# Altium project Quad.PrjPcb
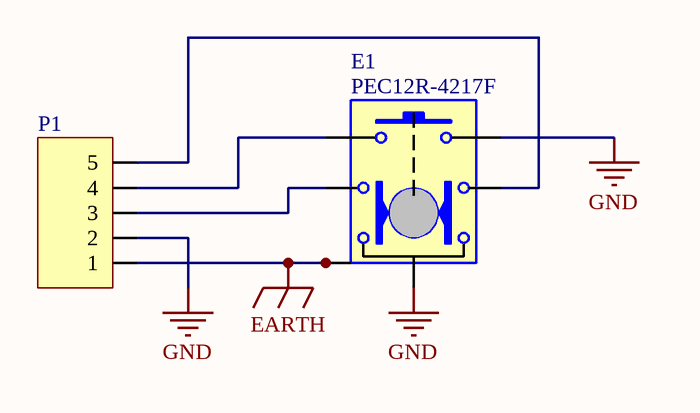
[diagram p0: QuadSwitch.SchDoc]
1 sheet, 2 parts. Net scope: global (net labels, ports and power ports of the same name join across sheets).
Board file: QuadSwitch.PcbDoc

## Sheet QuadSwitch.SchDoc
size A; SheetNumber: 1; SheetTotal: 1

### Parts
E1  PEC12R-4217F  [RotaryEncoder - PEC12R]
P1  Header, 5-Pin  [HDR1X5S]  (value not drawn)

### Nets
EARTH: E1.SHLD1 E1.SHLD2 P1.1
GND: E1.Common E1.SW1 P1.2
NetE1_PhaseA: E1.PhaseA P1.5
NetE1_PhaseB: E1.PhaseB P1.3
NetE1_SW2: E1.SW2 P1.4

### Library data of the parts
E1 = Rotary Encoder - PEC12R-4217F: Rotary Encoder Bourns 17.5 mm shaft; Digikey: PEC12R-4220F-N0024-ND; Farnell PN: *; LCSC: *
P1 = Header 1x5: LatestRevisionDate: 17-Jul-2002; LatestRevisionNote: Re-released for DXP Platform.; Publisher: Altium Limited; LCSC: *